# Altium project 2019_ACT_EXPANDER.PRJPCB
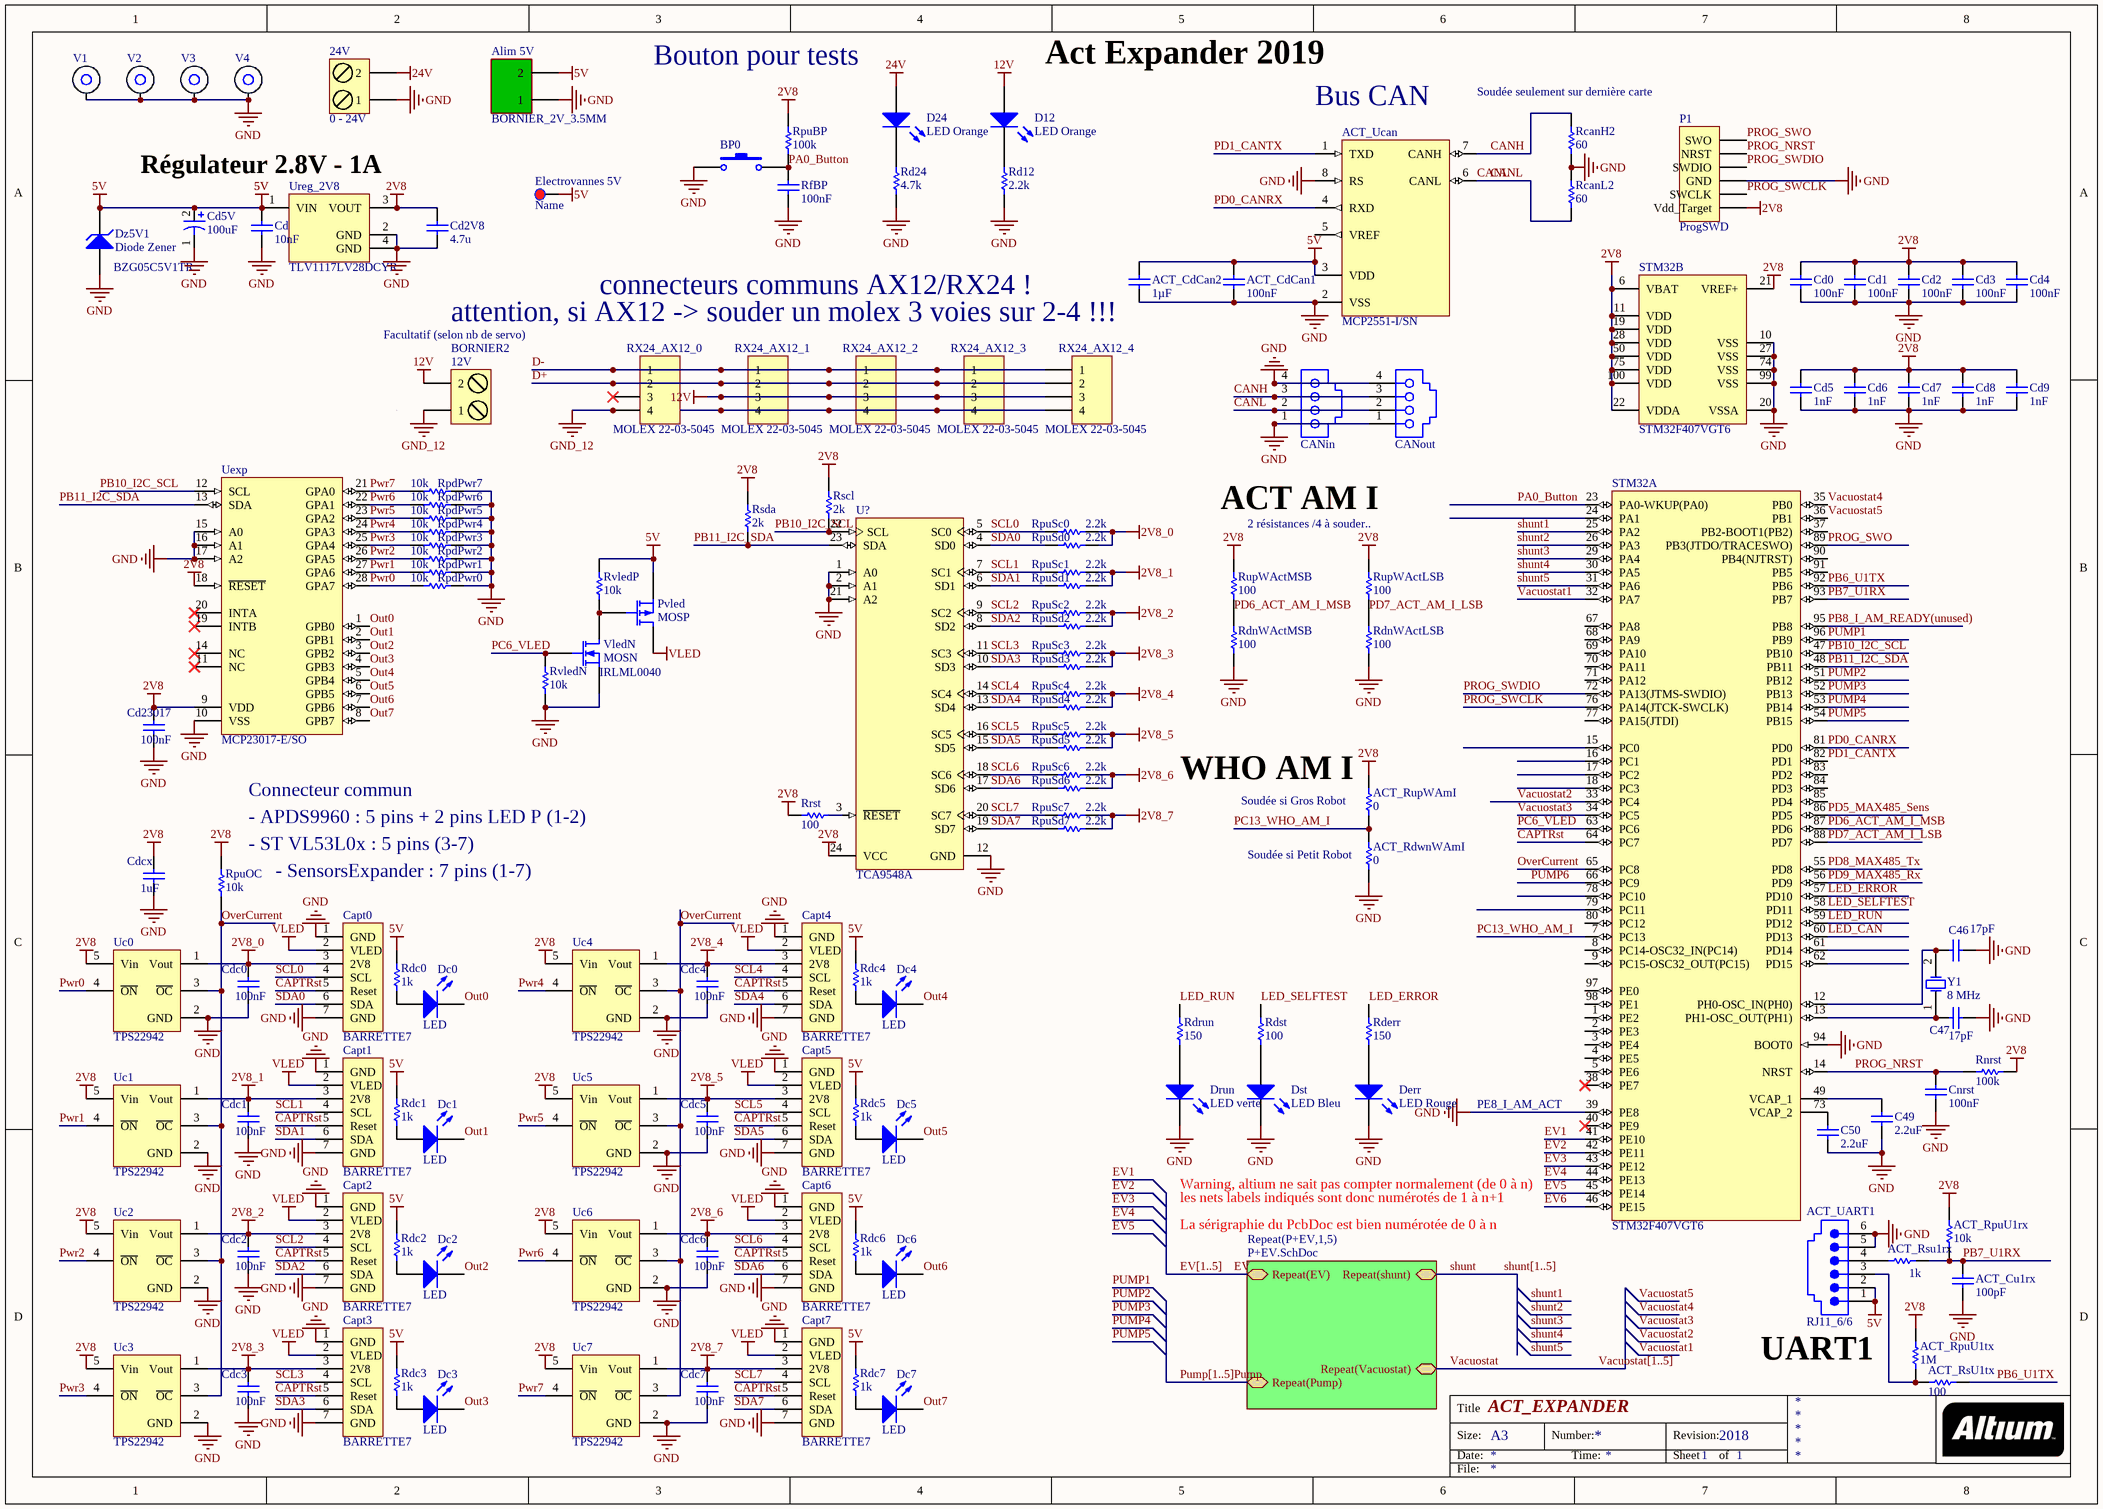
[diagram p0: 2019_ACT_EXPANDER.SchDoc]
2 sheets, 225 parts. Net scope: hierarchical (ports join the sheet entries above them; power ports are global).
Board file: 2019_ACT_EXPANDER.PCBDOC
Sheets:
  2019_ACT_EXPANDER.SchDoc
    P+EV1 = P+EV.SchDoc
    P+EV2 = P+EV.SchDoc
    P+EV3 = P+EV.SchDoc
    P+EV4 = P+EV.SchDoc
    P+EV5 = P+EV.SchDoc

## Sheet 2019_ACT_EXPANDER.SchDoc: ACT_EXPANDER
size A3; Engineer: Nirgal; Revision: 2018; SheetNumber: 1; SheetTotal: 1

### Parts
12V  BORNIER2  [BORNIER2]
24V  0 - 24V  [BORNIER2_FEM_COUDE]
ACT_CdCan1  100nF  [C0805_N]
ACT_CdCan2  1µF  [C0805_N]
ACT_Cu1rx  100pF  [C0805_N]
ACT_RdwnWAmI  0  [R1206_N]
ACT_RpuU1rx  10k  [R1206_N]
ACT_RpuU1tx  1M  [R1206_N]
ACT_Rsu1rx  1k  [R1206_N]
ACT_RsU1tx  100  [R1206_N]
ACT_RupWAmI  0  [R1206_N]
ACT_UART1  RJ11_6/6  [RJ11_6/6 - droit]
ACT_Ucan  MCP2551-I/SN  [SO8_N]
Alim_5V  BORNIER_2V_3.5MM  [BORNIER_2V_3.5MM]
BP0  SW_Pushbutton_6x6mm_Vertical  [Switch 6x6 Vertical]  (value not drawn)
C46  17pF  [C0805_N]
C47  17pF  [C0805_N]
C49  2.2uF  [C0805_N]
C50  2.2uF  [C0805_N]
CANin  634104149621  [634104149621]  (value not drawn)
CANout  634104149621  [634104149621]  (value not drawn)
Capt0  BARRETTE7  [MOLEX7_2.50MM]
Capt1  BARRETTE7  [MOLEX7_2.50MM]
Capt2  BARRETTE7  [MOLEX7_2.50MM]
Capt3  BARRETTE7  [MOLEX7_2.50MM]
Capt4  BARRETTE7  [MOLEX7_2.50MM]
Capt5  BARRETTE7  [MOLEX7_2.50MM]
Capt6  BARRETTE7  [MOLEX7_2.50MM]
Capt7  BARRETTE7  [MOLEX7_2.50MM]
Cd  10nF  [C0805_N]
Cd0  100nF  [C0805_N]
Cd1  100nF  [C0805_N]
Cd2  100nF  [C0805_N]
Cd2V8  4.7u  [C1206_N]
Cd3  100nF  [C0805_N]
Cd4  100nF  [C0805_N]
Cd5  1nF  [C0805_N]
Cd5V  100uF  [CONDENSATEUR_POLARISE_ELECTROLYTIQUE_RADIAL_5.08/8.9]
Cd6  1nF  [C0805_N]
Cd7  1nF  [C0805_N]
Cd8  1nF  [C0805_N]
Cd9  1nF  [C0805_N]
Cd23017  100nF  [C0805_N]
Cdc0  100nF  [C0805_N]
Cdc1  100nF  [C0805_N]
Cdc2  100nF  [C0805_N]
Cdc3  100nF  [C0805_N]
Cdc4  100nF  [C0805_N]
Cdc5  100nF  [C0805_N]
Cdc6  100nF  [C0805_N]
Cdc7  100nF  [C0805_N]
Cdcx  1uF  [C0805_N]
Cnrst  100nF  [C0805_N]
D12  LED Orange  [LED_0805]
D24  LED Orange  [LED_0805]
Dc0  LED  [LED_0805]
Dc1  LED  [LED_0805]
Dc2  LED  [LED_0805]
Dc3  LED  [LED_0805]
Dc4  LED  [LED_0805]
Dc5  LED  [LED_0805]
Dc6  LED  [LED_0805]
Dc7  LED  [LED_0805]
Derr  LED Rouge  [LED_0805]
Drun  LED verte  [LED_0805]
Dst  LED Bleu  [LED_0805]
Dz5V1  Diode Zener  [SMA Diode]
Electrovannes_5V  Name  [Point Test_D0.9_P0.5mm]
P1  ProgSWD  [HDR1X6]
Pvled  MOSP  [SOT23-3N]
RcanH2  60  [R1206_N]
RcanL2  60  [R1206_N]
Rd12  2.2k  [R1206_N]
Rd24  4.7k  [R1206_N]
Rdc0  1k  [R1206_N]
Rdc1  1k  [R1206_N]
Rdc2  1k  [R1206_N]
Rdc3  1k  [R1206_N]
Rdc4  1k  [R1206_N]
Rdc5  1k  [R1206_N]
Rdc6  1k  [R1206_N]
Rdc7  1k  [R1206_N]
Rderr  150  [R1206_N]
RdnWActLSB  100  [R1206_N]
RdnWActMSB  100  [R1206_N]
Rdrun  150  [R1206_N]
Rdst  100  [R1206_N]
RfBP  100nF  [C0805_N]
Rnrst  100k  [R1206_N]
RpdPwr0  10k  [R1206_N]
RpdPwr1  10k  [R1206_N]
RpdPwr2  10k  [R1206_N]
RpdPwr3  10k  [R1206_N]
RpdPwr4  10k  [R1206_N]
RpdPwr5  10k  [R1206_N]
RpdPwr6  10k  [R1206_N]
RpdPwr7  10k  [R1206_N]
RpuBP  100k  [R1206_N]
RpuOC  10k  [R1206_N]
RpuSc0  2.2k  [R1206_N]
RpuSc1  2.2k  [R1206_N]
RpuSc2  2.2k  [R1206_N]
RpuSc3  2.2k  [R1206_N]
RpuSc4  2.2k  [R1206_N]
RpuSc5  2.2k  [R1206_N]
RpuSc6  2.2k  [R1206_N]
RpuSc7  2.2k  [R1206_N]
RpuSd0  2.2k  [R1206_N]
RpuSd1  2.2k  [R1206_N]
RpuSd2  2.2k  [R1206_N]
RpuSd3  2.2k  [R1206_N]
RpuSd4  2.2k  [R1206_N]
RpuSd5  2.2k  [R1206_N]
RpuSd6  2.2k  [R1206_N]
RpuSd7  2.2k  [R1206_N]
Rrst  100  [R1206_N]
Rscl  2k  [R1206_N]
Rsda  2k  [R1206_N]
RupWActLSB  100  [R1206_N]
RupWActMSB  100  [R1206_N]
RvledN  10k  [R1206_N]
RvledP  10k  [R1206_N]
RX24_AX12_0  MOLEX 22-03-5045  [MOLEX4_2.5MM]
RX24_AX12_1  MOLEX 22-03-5045  [MOLEX4_2.5MM]
RX24_AX12_2  MOLEX 22-03-5045  [MOLEX4_2.5MM]
RX24_AX12_3  MOLEX 22-03-5045  [MOLEX4_2.5MM]
RX24_AX12_4  MOLEX 22-03-5045  [MOLEX4_2.5MM]
STM32  STM32F407VGT6  [STM-LQFP100_N]  (parts A,B of 2)
U?  TCA9548A  [DB24_N]
Uc0  TPS22942  [SOT23-5AN]
Uc1  TPS22942  [SOT23-5AN]
Uc2  TPS22942  [SOT23-5AN]
Uc3  TPS22942  [SOT23-5AN]
Uc4  TPS22942  [SOT23-5AN]
Uc5  TPS22942  [SOT23-5AN]
Uc6  TPS22942  [SOT23-5AN]
Uc7  TPS22942  [SOT23-5AN]
Uexp  MCP23017-E/SO  [SOIC-SO28_N]
Ureg_2V8  TLV1117LV28DCYR  [SOT223-4N]
V1  Entretoise WURTH CMS  [ENTRETOISE_CMS]  (value not drawn)
V2  Entretoise WURTH CMS  [ENTRETOISE_CMS]  (value not drawn)
V3  Entretoise WURTH CMS  [ENTRETOISE_CMS]  (value not drawn)
V4  Entretoise WURTH CMS  [ENTRETOISE_CMS]  (value not drawn)
VledN  MOSN  [SOT23-3N]
Y1  8 MHz  [HC49/4H_SMX]

### Sub-sheets
Repeat(P+EV,1,5) = P+EV.SchDoc: Repeat(EV), Repeat(Pump), Repeat(shunt), Repeat(Vacuostat)

### Nets
2V8: ACT_RpuU1rx.2 ACT_RpuU1tx.2 ACT_RupWAmI.2 Cd0.2 Cd1.2 Cd2.2 Cd2V8.2 Cd3.2 Cd4.2 Cd5.2 Cd6.2 Cd7.2 Cd8.2 Cd9.2 Cd23017.2 Cdcx.2 P1.1(Vdd_Target) Rnrst.2 RpuBP.1 RpuOC.1 Rrst.1 Rscl.1 Rsda.1 RupWActLSB.2 RupWActMSB.2 STM32.6(VBAT) STM32.11(VDD) STM32.19(VDD) STM32.21(VREF+) STM32.22(VDDA) STM32.28(VDD) STM32.50(VDD) STM32.75(VDD) STM32.100(VDD) U?.24(VCC) Uc0.5(Vin) Uc1.5(Vin) Uc2.5(Vin) Uc3.5(Vin) Uc4.5(Vin) Uc5.5(Vin) Uc6.5(Vin) Uc7.5(Vin) Uexp.9(VDD) Uexp.18(~{RESET}) Ureg_2V8.3(VOUT)
2V8_0: Capt0.3(2V8) Cdc0.2 RpuSc0.1 RpuSd0.1 Uc0.1(Vout)
2V8_1: Capt1.3(2V8) Cdc1.2 RpuSc1.1 RpuSd1.1 Uc1.1(Vout)
2V8_2: Capt2.3(2V8) Cdc2.2 RpuSc2.1 RpuSd2.1 Uc2.1(Vout)
2V8_3: Capt3.3(2V8) Cdc3.2 RpuSc3.1 RpuSd3.1 Uc3.1(Vout)
2V8_4: Capt4.3(2V8) Cdc4.2 RpuSc4.1 RpuSd4.1 Uc4.1(Vout)
2V8_5: Capt5.3(2V8) Cdc5.2 RpuSc5.1 RpuSd5.1 Uc5.1(Vout)
2V8_6: Capt6.3(2V8) Cdc6.2 RpuSc6.1 RpuSd6.1 Uc6.1(Vout)
2V8_7: Capt7.3(2V8) Cdc7.2 RpuSc7.1 RpuSd7.1 Uc7.1(Vout)
5V: ACT_CdCan1.2 ACT_CdCan2.2 ACT_UART1.1 ACT_UART1.2 ACT_Ucan.3(VDD) Alim_5V.2 Cd.2 Cd5V.2 Dz5V1.2(K) Electrovannes_5V.1 Pvled.3(S) Rdc0.1 Rdc1.1 Rdc2.1 Rdc3.1 Rdc4.1 Rdc5.1 Rdc6.1 Rdc7.1 RvledP.1 Ureg_2V8.1(VIN)
12V: 12V.2 D12.1(A) RX24_AX12_1.3 RX24_AX12_2.3 RX24_AX12_3.3 RX24_AX12_4.3
24V: 24V.2 D24.1(A)
GND: 24V.1 ACT_CdCan1.1 ACT_CdCan2.1 ACT_Cu1rx.1 ACT_RdwnWAmI.1 ACT_UART1.5 ACT_UART1.6 ACT_Ucan.2(VSS) ACT_Ucan.8(RS) Alim_5V.1 BP0.1 C46.1 C47.1 C49.1 C50.1 CANin.1 CANin.4 CANout.1 CANout.4 Capt0.1(GND) Capt0.7(GND) Capt1.1(GND) Capt1.7(GND) Capt2.1(GND) Capt2.7(GND) Capt3.1(GND) Capt3.7(GND) Capt4.1(GND) Capt4.7(GND) Capt5.1(GND) Capt5.7(GND) Capt6.1(GND) Capt6.7(GND) Capt7.1(GND) Capt7.7(GND) Cd.1 Cd0.1 Cd1.1 Cd2.1 Cd2V8.1 Cd3.1 Cd4.1 Cd5.1 Cd5V.1 Cd6.1 Cd7.1 Cd8.1 Cd9.1 Cd23017.1 Cdc0.1 Cdc1.1 Cdc2.1 Cdc3.1 Cdc4.1 Cdc5.1 Cdc6.1 Cdc7.1 Cdcx.1 Cnrst.1 Derr.2(K) Drun.2(K) Dst.2(K) Dz5V1.1(A) P1.3(GND) RcanH2.2 RcanL2.2 Rd12.2 Rd24.2 RdnWActLSB.1 RdnWActMSB.1 RfBP.1 RpdPwr0.2 RpdPwr1.2 RpdPwr2.2 RpdPwr3.2 RpdPwr4.2 RpdPwr5.2 RpdPwr6.2 RpdPwr7.2 RvledN.2 STM32.10(VSS) STM32.20(VSSA) STM32.27(VSS) STM32.39(PE8) STM32.74(VSS) STM32.94(BOOT0) STM32.99(VSS) U?.1(A0) U?.2(A1) U?.12(GND) U?.21(A2) Uc0.2(GND) Uc1.2(GND) Uc2.2(GND) Uc3.2(GND) Uc4.2(GND) Uc5.2(GND) Uc6.2(GND) Uc7.2(GND) Uexp.10(VSS) Uexp.15(A0) Uexp.16(A1) Uexp.17(A2) Ureg_2V8.2(GND) Ureg_2V8.4(GND) V1.1 V2.1 V3.1 V4.1 VledN.2(S)
GND_12: 12V.1 RX24_AX12_0.4 RX24_AX12_1.4 RX24_AX12_2.4 RX24_AX12_3.4 RX24_AX12_4.4
VLED: Capt0.2(VLED) Capt1.2(VLED) Capt2.2(VLED) Capt3.2(VLED) Capt4.2(VLED) Capt5.2(VLED) Capt6.2(VLED) Capt7.2(VLED) Pvled.1(D)
CANH: ACT_Ucan.7(CANH) CANin.3 CANout.3 RcanH2.1
CANL: ACT_Ucan.6(CANL) CANin.2 CANout.2 RcanL2.1
CAPTRst: Capt0.5(Reset) Capt1.5(Reset) Capt2.5(Reset) Capt3.5(Reset) Capt4.5(Reset) Capt5.5(Reset) Capt6.5(Reset) Capt7.5(Reset) STM32.64(PC7)
D+: RX24_AX12_0.2 RX24_AX12_1.2 RX24_AX12_2.2 RX24_AX12_3.2 RX24_AX12_4.2
D-: RX24_AX12_0.1 RX24_AX12_1.1 RX24_AX12_2.1 RX24_AX12_3.1 RX24_AX12_4.1
EV: sheet Repeat(P+EV,1,5)/Repeat(EV)
EV1: STM32.41(PE10)
EV2: STM32.42(PE11)
EV3: STM32.43(PE12)
EV4: STM32.44(PE13)
EV5: STM32.45(PE14)
EV6: STM32.46(PE15)
LED_CAN: STM32.60(PD13)
LED_ERROR: Rderr.1 STM32.57(PD10)
LED_RUN: Rdrun.1 STM32.59(PD12)
LED_SELFTEST: Rdst.1 STM32.58(PD11)
Out0: Dc0.2(K) Uexp.1(GPB0)
Out1: Dc1.2(K) Uexp.2(GPB1)
Out2: Dc2.2(K) Uexp.3(GPB2)
Out3: Dc3.2(K) Uexp.4(GPB3)
Out4: Dc4.2(K) Uexp.5(GPB4)
Out5: Dc5.2(K) Uexp.6(GPB5)
Out6: Dc6.2(K) Uexp.7(GPB6)
Out7: Dc7.2(K) Uexp.8(GPB7)
OverCurrent: RpuOC.2 STM32.65(PC8) Uc0.3(~{OC}) Uc1.3(~{OC}) Uc2.3(~{OC}) Uc3.3(~{OC}) Uc4.3(~{OC}) Uc5.3(~{OC}) Uc6.3(~{OC}) Uc7.3(~{OC})
PA0_Button: BP0.3 RfBP.2 RpuBP.2 STM32.23(PA0-WKUP(PA0))
PB6_U1TX: ACT_RsU1tx.2 STM32.92(PB6)
PB7_U1RX: ACT_Cu1rx.2 ACT_RpuU1rx.1 ACT_Rsu1rx.1 STM32.93(PB7)
PB8_I_AM_READY(unused): STM32.95(PB8)
PB10_I2C_SCL: Rscl.2 STM32.47(PB10) U?.22(SCL) Uexp.12(SCL)
PB11_I2C_SDA: Rsda.2 STM32.48(PB11) U?.23(SDA) Uexp.13(SDA)
PC6_VLED: RvledN.1 STM32.63(PC6) VledN.1(G)
PC13_WHO_AM_I: ACT_RdwnWAmI.2 ACT_RupWAmI.1 STM32.7(PC13)
PD0_CANRX: ACT_Ucan.4(RXD) STM32.81(PD0)
PD1_CANTX: ACT_Ucan.1(TXD) STM32.82(PD1)
PD5_MAX485_Sens: STM32.86(PD5)
PD6_ACT_AM_I_MSB: RdnWActMSB.2 RupWActMSB.1 STM32.87(PD6)
PD7_ACT_AM_I_LSB: RdnWActLSB.2 RupWActLSB.1 STM32.88(PD7)
PD8_MAX485_Tx: STM32.55(PD8)
PD9_MAX485_Rx: STM32.56(PD9)
PROG_NRST: Cnrst.2 P1.5(NRST) Rnrst.1 STM32.14(NRST)
PROG_SWCLK: P1.2(SWCLK) STM32.76(PA14(JTCK-SWCLK))
PROG_SWDIO: P1.4(SWDIO) STM32.72(PA13(JTMS-SWDIO))
PROG_SWO: P1.6(SWO) STM32.89(PB3(JTDO/TRACESWO))
Pump: sheet Repeat(P+EV,1,5)/Repeat(Pump)
PUMP1: STM32.96(PB9)
PUMP2: STM32.51(PB12)
PUMP3: STM32.52(PB13)
PUMP4: STM32.53(PB14)
PUMP5: STM32.54(PB15)
PUMP6: STM32.66(PC9)
Pwr0: RpdPwr0.1 Uc0.4(~{ON}) Uexp.28(GPA7)
Pwr1: RpdPwr1.1 Uc1.4(~{ON}) Uexp.27(GPA6)
Pwr2: RpdPwr2.1 Uc2.4(~{ON}) Uexp.26(GPA5)
Pwr3: RpdPwr3.1 Uc3.4(~{ON}) Uexp.25(GPA4)
Pwr4: RpdPwr4.1 Uc4.4(~{ON}) Uexp.24(GPA3)
Pwr5: RpdPwr5.1 Uc5.4(~{ON}) Uexp.23(GPA2)
Pwr6: RpdPwr6.1 Uc6.4(~{ON}) Uexp.22(GPA1)
Pwr7: RpdPwr7.1 Uc7.4(~{ON}) Uexp.21(GPA0)
SCL0: Capt0.4(SCL) RpuSc0.2 U?.5(SC0)
SCL1: Capt1.4(SCL) RpuSc1.2 U?.7(SC1)
SCL2: Capt2.4(SCL) RpuSc2.2 U?.9(SC2)
SCL3: Capt3.4(SCL) RpuSc3.2 U?.11(SC3)
SCL4: Capt4.4(SCL) RpuSc4.2 U?.14(SC4)
SCL5: Capt5.4(SCL) RpuSc5.2 U?.16(SC5)
SCL6: Capt6.4(SCL) RpuSc6.2 U?.18(SC6)
SCL7: Capt7.4(SCL) RpuSc7.2 U?.20(SC7)
SDA0: Capt0.6(SDA) RpuSd0.2 U?.4(SD0)
SDA1: Capt1.6(SDA) RpuSd1.2 U?.6(SD1)
SDA2: Capt2.6(SDA) RpuSd2.2 U?.8(SD2)
SDA3: Capt3.6(SDA) RpuSd3.2 U?.10(SD3)
SDA4: Capt4.6(SDA) RpuSd4.2 U?.13(SD4)
SDA5: Capt5.6(SDA) RpuSd5.2 U?.15(SD5)
SDA6: Capt6.6(SDA) RpuSd6.2 U?.17(SD6)
SDA7: Capt7.6(SDA) RpuSd7.2 U?.19(SD7)
shunt: sheet Repeat(P+EV,1,5)/Repeat(shunt)
shunt1: STM32.25(PA2)
shunt2: STM32.26(PA3)
shunt3: STM32.29(PA4)
shunt4: STM32.30(PA5)
shunt5: STM32.31(PA6)
Vacuostat: sheet Repeat(P+EV,1,5)/Repeat(Vacuostat)
Vacuostat1: STM32.32(PA7)
Vacuostat2: STM32.33(PC4)
Vacuostat3: STM32.34(PC5)
Vacuostat4: STM32.35(PB0)
Vacuostat5: STM32.36(PB1)
NetACT_RpuU1tx_1: ACT_RpuU1tx.1 ACT_RsU1tx.1 ACT_UART1.3
NetACT_Rsu1rx_2: ACT_Rsu1rx.2 ACT_UART1.4
NetC46_2: C46.2 STM32.12(PH0-OSC_IN(PH0)) Y1.2(OSC2)
NetC47_2: C47.2 STM32.13(PH1-OSC_OUT(PH1)) Y1.1(OSC1)
NetC49_2: C49.2 STM32.49(VCAP_1)
NetC50_2: C50.2 STM32.73(VCAP_2)
NetD12_2: D12.2(K) Rd12.1
NetD24_2: D24.2(K) Rd24.1
NetDc0_1: Dc0.1(A) Rdc0.2
NetDc1_1: Dc1.1(A) Rdc1.2
NetDc2_1: Dc2.1(A) Rdc2.2
NetDc3_1: Dc3.1(A) Rdc3.2
NetDc4_1: Dc4.1(A) Rdc4.2
NetDc5_1: Dc5.1(A) Rdc5.2
NetDc6_1: Dc6.1(A) Rdc6.2
NetDc7_1: Dc7.1(A) Rdc7.2
NetDerr_1: Derr.1(A) Rderr.2
NetDrun_1: Drun.1(A) Rdrun.2
NetDst_1: Dst.1(A) Rdst.2
NetPvled_2: Pvled.2(G) RvledP.2 VledN.3(D)
NetRrst_2: Rrst.2 U?.3(~{RESET})

Not connected (* = marked no-connect by the designer): ACT_Ucan 5(VREF); RX24_AX12_0 3*; STM32 1(PE2) 2(PE3) 3(PE4) 4(PE5) 5(PE6) 8(PC14-OSC32_IN(PC14)) 9(PC15-OSC32_OUT(PC15)) 15(PC0) 16(PC1) 17(PC2) 18(PC3) 24(PA1) 37(PB2-BOOT1(PB2)) 38(PE7)* 40(PE9)* 61(PD14) 62(PD15) 67(PA8) 68(PA9) 69(PA10) 70(PA11) 71(PA12) 77(PA15(JTDI)) 78(PC10) 79(PC11) 80(PC12) 83(PD2) 84(PD3) 85(PD4) 90(PB4(NJTRST)) 91(PB5) 97(PE0) 98(PE1); Uexp 11(NC)* 14(NC)* 19(INTB)* 20(INTA)*

### Buses and harness runs
bus EV[1..5]
bus Pump[1..5]
bus shunt[1..5]
bus Vacuostat[1..5]

### Notes on the sheet
- Bouton pour tests
- Act Expander 2019
- (near ACT_Ucan) Bus CAN
- (near RcanH2) Soudée seulement sur dernière carte
- Régulateur 2.8V - 1A
- connecteurs communs AX12/RX24 !
- (near 12V) Facultatif (selon nb de servo)
- attention, si AX12 -> souder un molex 3 voies sur 2-4 !!!
- ACT AM I
- 2 résistances /4 à souder..
- WHO AM I
- Connecteur commun
- (near RpuOC) - APDS9960 : 5 pins + 2 pins LED P (1-2)
- (near RpuOC) - ST VL53L0x : 5 pins (3-7)
- (near ACT_RupWAmI) Soudée si Gros Robot
- (near ACT_RdwnWAmI) Soudée si Petit Robot
- - SensorsExpander : 7 pins (1-7)
- PE8_I_AM_ACT
- (near STM32) Warning, altium ne sait pas compter normalement (de 0 à n)
- (near STM32) les nets labels indiqués sont donc numérotés de 1 à n+1
- La sérigraphie du PcbDoc est bien numérotée de 0 à n
- (near ACT_UART1) UART1
- Title
- Size:
- Date:
- A3
- Number:
- Time:
- Revision:
- Sheet
- of
- File:
- (in symbol Diode Zener) BZG05C5V1TR
- (in symbol Transistor MOSFET-N) IRLML0040

### Library data of the parts
12V 24V = BORNIER2: Terminal blocks, 2 pins, pitch=5mm
ACT_CdCan1 ACT_CdCan2 ACT_Cu1rx C46 C47 C49 C50 Cd Cd0-Cd9 Cd23017 Cdc0-Cdc7 Cdcx Cnrst RfBP = Condensateur: Capacitor; Published: 8-Jun-2000; LatestRevisionDate: 17-Jul-2002; LatestRevisionNote: Re-released for DXP Platform.; PackageReference: RAD-0.3; Publisher: Altium Limited
ACT_RdwnWAmI ACT_RpuU1rx ACT_RpuU1tx ACT_Rsu1rx ACT_RsU1tx ACT_RupWAmI RcanH2 RcanL2 Rd12 Rd24 Rdc0-Rdc7 Rderr RdnWActLSB RdnWActMSB Rdrun Rdst Rnrst RpdPwr0-RpdPwr7 RpuBP RpuOC RpuSc0-RpuSc7 RpuSd0-RpuSd7 Rrst Rscl Rsda RupWActLSB RupWActMSB RvledN RvledP = Resistor: Published: 8-Jun-2000; LatestRevisionDate: 17-Jul-2002; LatestRevisionNote: Re-released for DXP Platform.; PackageReference: AXIAL-0.5; Publisher: Altium Limited
ACT_UART1 = RJ11_6/6: Right Angle, Standard Profile, Offset Latch DECconnect, Flangeless PCB Jack; Ports: 1; Positions/Loaded: Port1 - 6 Offset Latch/6; PerformanceCategory: 3; PCB_Mounting: Thru-Hole; DrillSize: Nominal, Rounded to nearest 0.05mm; PCB_Layout: Complies with Manufacturer's Recommendation.; Published: 25-Jun-2002; DatasheetDocument: 18-Dec-2001; PackageDocument: 18-Dec-2001; PackageReference: 15-43-6110; Publisher: Altium Limited; ComponentLink1Description: Manufacturer Link; ComponentLink1URL: http://www.molex.com/; ComponentLink2Description: Datasheet; ComponentLink2URL: http://www.molex.com/cmc_upload/common_files/1212003_41369catalogpage.pdf; Type: RJ11_6/6
ACT_Ucan = MCP2551-I/SN: High-Speed CAN Transceiver, 8-Pin SOIC, Industrial Temperature; Published: 25/11/09; DatasheetVersion: revE, Jan-2007; PackageVersion: revAW, Oct-2008; PackageReference: SOIC-SN8; Publisher: Damien Guitton; PackageDescription: 8-Lead Plastic Small Outline (SN) - Narrow, 3.90mm Body [SOIC]; Code_JEDEC: MS-012; Code_IPC: SOIC127P600-8; ComponentLink1Description: Manufacturer Link; ComponentLink1URL: http://www.microchip.com; ComponentLink2Description: Datasheet; ComponentLink2URL: http://ww1.microchip.com/downloads/en/DeviceDoc/21667E.pdf; ComponentLink3Description: Packaging Specification; ComponentLink3URL: http://ww1.microchip.com/downloads/en/PackagingSpec/00049AW.pdf
BP0 = SW_Pushbutton_6x6mm_Vertical: Switch tactil 6mm x 6mm Vertical; Published: 27/11/09; PackageReference: 6mm X 6mm; Publisher: Damien Guitton
CANin CANout = 634104149621: Modular Jack SMT Vertical Plastic 4P4C Top Entry WR-MJ; Rated Current: 1.5 A; Working Voltage: 120 VAC; Withstanding Voltage: 1000 VAC; Port: 1x1; ComponentLink1Description: Manufacturer; ComponentLink1URL: http://www.we-online.de; ComponentLink2Description: Datasheet; ComponentLink2URL: http://katalog.we-online.com/em/datasheet/634104149621.pdf; Part Number: 634104149621; Published Date: September 2017; Publisher: Wurth Elektronik; Pin Number: 4P4C; Entrance: Vertical
Capt0-Capt7 = BARRETTE7: Header, 6-Pin; LatestRevisionDate: 17-Jul-2002; LatestRevisionNote: Re-released for DXP Platform.; Publisher: Altium Limited
Cd2V8 = Capacitor: Published: 8-Jun-2000; LatestRevisionDate: 17-Jul-2002; LatestRevisionNote: Re-released for DXP Platform.; PackageReference: RAD-0.3; Publisher: Altium Limited
Cd5V = Condensateur Polarise Traversant: Polarized Capacitor
D12 D24 Dc0-Dc7 Derr Drun Dst = LED: Typical LED; Published: 8-Jun-2000; LatestRevisionDate: 08-Jul-2005; LatestRevisionNote: Mech Layer 1 removed.; PackageReference: LED-1; Publisher: Altium Limited
Dz5V1 = Diode Zener: Zener Diode
Electrovannes_5V = Point Test: Publisher: Damien GUITTON
P1 = Header 6: Header, 6-Pin; LatestRevisionDate: 17-Jul-2002; LatestRevisionNote: Re-released for DXP Platform.; Publisher: Altium Limited
Pvled = Transistor MOSFET-P: P-Channel MOSFET; PackageDocument: 1995/1996; Published: 8-Jun-2000; LatestRevisionDate: 17-Jul-2002; LatestRevisionNote: Re-released for DXP Platform.; PackageReference: E3; Publisher: Altium Limited
RX24_AX12_0-RX24_AX12_4 = BARRETTE4: Header, 4-Pin; LatestRevisionDate: 17-Jul-2002; LatestRevisionNote: Re-released for DXP Platform.; Publisher: Altium Limited
STM32 = STM32F407VGT6: ARM Cortex-M4 32-bit MCU+FPU, 210 DMIPS, 1024 kB Flash, 192 kB Internal RAM, 82 I/Os, 100-pin LQFP, -40 to 85 degC, Tray; Manufacturer: STMicroelectronics; D/A Converter: 2x12-bit; FLASH Size (Prog) (kB): 1024; I/Os (High Current): 82; Internal RAM Size (kB): 192; Operating Frequency(F) (Processor speed) (MHz): 168; Supply Voltage(Vcc) max (V): 3.6; Supply Voltage(Vcc) min (V): 1.8; DatasheetVersion: Rev. 4; PackageVersion: Rev. 1, 06/2013; PackageReference: LQFP100; PackageDescription: 100-Pin Low Profile Quad Flat Package, 14 x 14 mm Body, 0.5 mm Pitch; Supplier 1: Digi-Key; Supplier Part Number 1: 497-11605-ND; Supplier 2: Farnell; Supplier Part Number 2: 2064368; Supplier 3: Newark; Supplier Part Number 3: 73T2333; Supplier 4: Mouser; Supplier Part Number 4: 511-STM32F407VGT6; Core: ARM Cortex-M4; Packing: Tray; Mounting Technology: Surface Mount; PartNumber: STM32F407VGT6; ComponentLink1Description: Manufacturer URL; ComponentLink1URL: http://www.st.com/web/en/home.html; ComponentLink2Description: Datasheet; ComponentLink2URL: http://www.st.com/st-web-ui/static/active/en/resource/technical/document/datasheet/DM00037051.pdf; ComponentLink3Description: Package Specification; ComponentLink3URL: http://www.st.com/st-web-ui/static/active/en/resource/technical/document/data_brief/DM00071938.pdf
U? = PCA9548ADB: 8-Channel I2C Switch with Reset, 2.3 to 5.5 V, -40 to 85 degC, 24-pin SSOP (DB), Green (RoHS & no Sb/Br); Manufacturer: Texas Instruments; SubFamily: I2C Multiplexer, Switch; Technology Family: PCA; fSCLK(Max)(MHz): 100, 400; VCC(Min)(V): 2.3; VCC(Max)(V): 5.5; Max Frequency(kHz): 400; I2C Address: 1110 xxx; Channel Width: 8; Reset Input: Yes; Simultaneously Active Channels: 1 to 8; DatasheetVersion: SCPS143C; PackageVersion: revE, Dec-2001; PackageReference: DB24; PackageDescription: 24-Pin Plastic Small Outline Package, 8.2 x 5.3 mm Body, 0.65 mm Pitch; Supplier 1: Digi-Key; Supplier Part Number 1: PCA9548ADB-ND; Supplier 2: Farnell; Supplier Part Number 2: 1574999; Supplier 3: Newark; Supplier Part Number 3: 22M1598; Supplier 4: Mouser; Supplier Part Number 4: 595-PCA9548ADB; Eco-Plan: Green (RoHS & no Sb/Br); Vcc range(V): 2.3 to 5.5; 5V Tolerant I/O: Yes; Open Drain I/O Type: Yes; Mounting Technology: Surface Mount; PartNumber: PCA9548ADB; Code_JEDEC: MO-150; ComponentLink1Description: Datasheet; ComponentLink1URL: http://www.ti.com/general/docs/lit/getliterature.tsp?genericPartNumber=PCA9548A&fileType=pdf; ComponentLink2Description: Package Specification; ComponentLink2URL: http://www.ti.com/litv/pdf/mpds211a
Uexp = MCP23017-E/SO: 16-Bit I/O Expander with Serial Interface, 28-Pin SOIC, Extended Temperature; Manufacturer: Microchip; DatasheetVersion: revB, Feb-2007; PackageVersion: revBB, Aug-2009; PackageReference: SOIC-SO28; PackageDescription: 28-Lead Plastic Small Outline (SO) - Wide 7.50mm Body [SOIC]; Supplier 1: Digi-Key; Supplier Part Number 1: MCP23017-E/SO-ND; Supplier 2: Farnell; Supplier Part Number 2: 1332087; Supplier 3: Newark; Supplier Part Number 3: 31K2958; Supplier 4: Newark; Supplier Part Number 4: 34M7442; Supplier 5: Mouser; Supplier Part Number 5: 579-MCP23017-E/SO; Mounting Technology: Surface Mount; Code_JEDEC: MS-013; PartNumber: MCP23017-E/SO; ComponentLink1Description: Manufacturer URL; ComponentLink1URL: http://www.microchip.com/; ComponentLink2Description: Datasheet; ComponentLink2URL: http://ww1.microchip.com/downloads/en/DeviceDoc/21952b.pdf; ComponentLink3Description: Package Specification; ComponentLink3URL: http://www.microchip.com/stellent/groups/techpub_sg/documents/packagingspec/en012702.pdf
Ureg_2V8 = MCP1826S-3302E/DB: 1000 mA, Low Voltage, Low Quiescent Current LDO Regulator, 3-Pin SOT-223, Extended Temperature; FirstPublished: 29-Jan-2009; DatasheetVersion: revA, Aug-2007; PackageVersion: revBB, Aug-2009; PackageReference: SOT-223-DB3; Publisher: Altium Limited; PackageDescription: 3-Lead Plastic Small Outline Transistor (DB) [SOT-223]; Supplier 1: Digi-Key; Supplier Part Number 1: MCP1826S-3302E/DB-ND; Supplier 2: Farnell; Supplier Part Number 2: 1578424; Supplier 3: Newark; Supplier Part Number 3: 27M0037; ComponentLink1Description: Datasheet; ComponentLink1URL: http://ww1.microchip.com/downloads/en/DeviceDoc/22057a.pdf; ComponentLink2Description: Packaging Specification; ComponentLink2URL: http://www.microchip.com/stellent/groups/techpub_sg/documents/packagingspec/en012702.pdf; ComponentLink3Description: Microchip.com Home; ComponentLink3URL: http://www.microchip.com/
V1-V4 = Entretoise WURTH CMS: Entretoise Wurth; Publisher: Damien Guitton
VledN = Transistor MOSFET-N: N-Channel MOSFET; PackageDocument: 1995/1996; Published: 8-Jun-2000; LatestRevisionDate: 17-Jul-2002; LatestRevisionNote: Re-released for DXP Platform.; PackageReference: E3; Publisher: Altium Limited
Y1 = Quartz: Crystal Oscillator; Published: 8-Jun-2000; LatestRevisionDate: 17-Jul-2002; LatestRevisionNote: Re-released for DXP Platform.; PackageReference: R38; Publisher: Altium Limited

## Sheet P+EV.SchDoc
size A4
Used 5 times, as channels P+EV1, P+EV2, P+EV3, P+EV4, P+EV5. Parts and nets are listed once, with the designators drawn on the sheet.
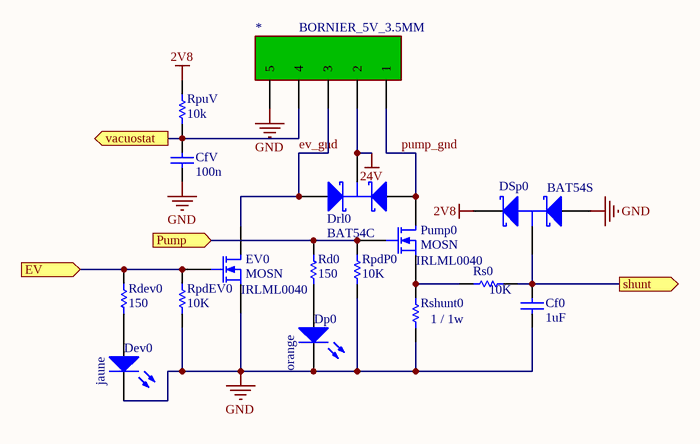
[diagram p1: P+EV.SchDoc]

### Parts
*  BORNIER_5V_3.5MM  [BORNIER_5V_3.5MM_femelle_90]
Cf0  1uF  [C0805_N]
CfV  100n  [C0805_N]
Dev0  jaune  [LED_0805]
Dp0  orange  [LED_0805]
Drl0  BAT54C  [SOT23-3N]
DSp0  BAT54S  [SOT23-3N]
EV0  MOSN  [SOT23-3N]
Pump0  MOSN  [SOT23-3N]
Rd0  150  [R1206_N]
Rdev0  150  [R1206_N]
RpdEV0  10K  [R1206_N]
RpdP0  10K  [R1206_N]
RpuV  10k  [R1206_N]
Rs0  10K  [R1206_N]
Rshunt0  1 / 1w  [INDUCTANCE_CMS_1812]

### Ports
EV (in), Pump (in), shunt (out), vacuostat (out)

### Nets
2V8: DSp0.2(K) RpuV.2
24V: *.2 Drl0.3(K)
GND: *.5 Cf0.1 CfV.1 Dev0.2(K) Dp0.2(K) DSp0.1(A) EV0.2(S) RpdEV0.1 RpdP0.1 Rshunt0.1
EV: EV0.1(G) Rdev0.2 RpdEV0.2 ; port EV
ev_gnd: *.3 Drl0.1(A1) EV0.3(D)
Pump: Pump0.1(G) Rd0.2 RpdP0.2 ; port Pump
pump_gnd: *.1 Drl0.2(A2) Pump0.3(D)
shunt: Cf0.2 DSp0.3(C) Rs0.2 ; port shunt
vacuostat: *.4 CfV.2 RpuV.1 ; port vacuostat
NetDev0_1: Dev0.1(A) Rdev0.1
NetDp0_1: Dp0.1(A) Rd0.1
NetPump0_2: Pump0.2(S) Rs0.1 Rshunt0.2

### Channels
P+EV1: designators end in _P+EV1; ports EV=EV1 Pump=PUMP1 shunt=shunt1 vacuostat=Vacuostat1
P+EV2: designators end in _P+EV2; ports EV=EV2 Pump=PUMP2 shunt=shunt2 vacuostat=Vacuostat2
P+EV3: designators end in _P+EV3; ports EV=EV3 Pump=PUMP3 shunt=shunt3 vacuostat=Vacuostat3
P+EV4: designators end in _P+EV4; ports EV=EV4 Pump=PUMP4 shunt=shunt4 vacuostat=Vacuostat4
P+EV5: designators end in _P+EV5; ports EV=EV5 Pump=PUMP5 shunt=shunt5 vacuostat=Vacuostat5

### Notes on the sheet
- (in symbol Transistor MOSFET-N) IRLML0040

### Library data of the parts
Cf0 CfV = Condensateur: Capacitor; Published: 8-Jun-2000; LatestRevisionDate: 17-Jul-2002; LatestRevisionNote: Re-released for DXP Platform.; PackageReference: RAD-0.3; Publisher: Altium Limited
Dev0 Dp0 = LED: Typical LED; Published: 8-Jun-2000; LatestRevisionDate: 08-Jul-2005; LatestRevisionNote: Mech Layer 1 removed.; PackageReference: LED-1; Publisher: Altium Limited
Drl0 = Diode Shottky double BAT54C: DIODE SCHOTTKY DOUBLE; Manufacturer: ZETEX; Diode Case Style: SOT-23; Supplier Part Number: 9526501; Supplier: Farnell; ComponentLink1URL: http://www.farnell.com/datasheets/27632.pdf; ComponentLink1Description: http://www.farnell.com/datasheets/27632.pdf; Pricing: 5=0,32, 25=0,23, 100=0,198, 1000=0,154 (EUR); RoHS: YES; Manufacturer Part Number: BAT54C
DSp0 = Diode Shottky double BAT54S: DIODE SCHOTTKY DOUBLE; Manufacturer: ZETEX; ComponentLink1URL: http://www.farnell.com/datasheets/27632.pdf; ComponentLink1Description: http://www.farnell.com/datasheets/27632.pdf; Supplier: Farnell; RoHS: YES; Supplier Part Number: 9526510; Pricing: 5=0,32, 25=0,26, 100=0,21, 1000=0,17 (EUR); Manufacturer Part Number: BAT54S
EV0 Pump0 = Transistor MOSFET-N: as VledN on sheet 2019_ACT_EXPANDER; Published: 8-Jun-2000; LatestRevisionDate: 17-Jul-2002; LatestRevisionNote: Re-released for DXP Platform.; PackageReference: E3; Publisher: Altium Limited
Rd0 Rdev0 RpdEV0 RpdP0 RpuV Rs0 Rshunt0 = Resistor: Published: 8-Jun-2000; LatestRevisionDate: 17-Jul-2002; LatestRevisionNote: Re-released for DXP Platform.; PackageReference: AXIAL-0.5; Publisher: Altium Limited

## Nets that join several sheets
2V8: 2019_ACT_EXPANDER (46 pins), P+EV1 (DSp0_P+EV1.2 RpuV_P+EV1.2), P+EV2 (DSp0_P+EV2.2 RpuV_P+EV2.2), P+EV3 (DSp0_P+EV3.2 RpuV_P+EV3.2), P+EV4 (DSp0_P+EV4.2 RpuV_P+EV4.2), P+EV5 (DSp0_P+EV5.2 RpuV_P+EV5.2)
24V: 2019_ACT_EXPANDER (24V.2 D24.1), P+EV1 (*_P+EV1.2 Drl0_P+EV1.3), P+EV2 (*_P+EV2.2 Drl0_P+EV2.3), P+EV3 (*_P+EV3.2 Drl0_P+EV3.3), P+EV4 (*_P+EV4.2 Drl0_P+EV4.3), P+EV5 (*_P+EV5.2 Drl0_P+EV5.3)
GND: 2019_ACT_EXPANDER (110 pins), P+EV1 (10 pins), P+EV2 (10 pins), P+EV3 (10 pins), P+EV4 (10 pins), P+EV5 (10 pins)
EV1: 2019_ACT_EXPANDER (STM32.41), P+EV1 (EV0_P+EV1.1 Rdev0_P+EV1.2 RpdEV0_P+EV1.2)
EV2: 2019_ACT_EXPANDER (STM32.42), P+EV2 (EV0_P+EV2.1 Rdev0_P+EV2.2 RpdEV0_P+EV2.2)
EV3: 2019_ACT_EXPANDER (STM32.43), P+EV3 (EV0_P+EV3.1 Rdev0_P+EV3.2 RpdEV0_P+EV3.2)
EV4: 2019_ACT_EXPANDER (STM32.44), P+EV4 (EV0_P+EV4.1 Rdev0_P+EV4.2 RpdEV0_P+EV4.2)
EV5: 2019_ACT_EXPANDER (STM32.45), P+EV5 (EV0_P+EV5.1 Rdev0_P+EV5.2 RpdEV0_P+EV5.2)
PUMP1: 2019_ACT_EXPANDER (STM32.96), P+EV1 (Pump0_P+EV1.1 Rd0_P+EV1.2 RpdP0_P+EV1.2)
PUMP2: 2019_ACT_EXPANDER (STM32.51), P+EV2 (Pump0_P+EV2.1 Rd0_P+EV2.2 RpdP0_P+EV2.2)
PUMP3: 2019_ACT_EXPANDER (STM32.52), P+EV3 (Pump0_P+EV3.1 Rd0_P+EV3.2 RpdP0_P+EV3.2)
PUMP4: 2019_ACT_EXPANDER (STM32.53), P+EV4 (Pump0_P+EV4.1 Rd0_P+EV4.2 RpdP0_P+EV4.2)
PUMP5: 2019_ACT_EXPANDER (STM32.54), P+EV5 (Pump0_P+EV5.1 Rd0_P+EV5.2 RpdP0_P+EV5.2)
shunt1: 2019_ACT_EXPANDER (STM32.25), P+EV1 (Cf0_P+EV1.2 DSp0_P+EV1.3 Rs0_P+EV1.2)
shunt2: 2019_ACT_EXPANDER (STM32.26), P+EV2 (Cf0_P+EV2.2 DSp0_P+EV2.3 Rs0_P+EV2.2)
shunt3: 2019_ACT_EXPANDER (STM32.29), P+EV3 (Cf0_P+EV3.2 DSp0_P+EV3.3 Rs0_P+EV3.2)
shunt4: 2019_ACT_EXPANDER (STM32.30), P+EV4 (Cf0_P+EV4.2 DSp0_P+EV4.3 Rs0_P+EV4.2)
shunt5: 2019_ACT_EXPANDER (STM32.31), P+EV5 (Cf0_P+EV5.2 DSp0_P+EV5.3 Rs0_P+EV5.2)
Vacuostat1: 2019_ACT_EXPANDER (STM32.32), P+EV1 (*_P+EV1.4 CfV_P+EV1.2 RpuV_P+EV1.1)
Vacuostat2: 2019_ACT_EXPANDER (STM32.33), P+EV2 (*_P+EV2.4 CfV_P+EV2.2 RpuV_P+EV2.1)
Vacuostat3: 2019_ACT_EXPANDER (STM32.34), P+EV3 (*_P+EV3.4 CfV_P+EV3.2 RpuV_P+EV3.1)
Vacuostat4: 2019_ACT_EXPANDER (STM32.35), P+EV4 (*_P+EV4.4 CfV_P+EV4.2 RpuV_P+EV4.1)
Vacuostat5: 2019_ACT_EXPANDER (STM32.36), P+EV5 (*_P+EV5.4 CfV_P+EV5.2 RpuV_P+EV5.1)